# EAGLE design Control (EAGLE 9.6.2)
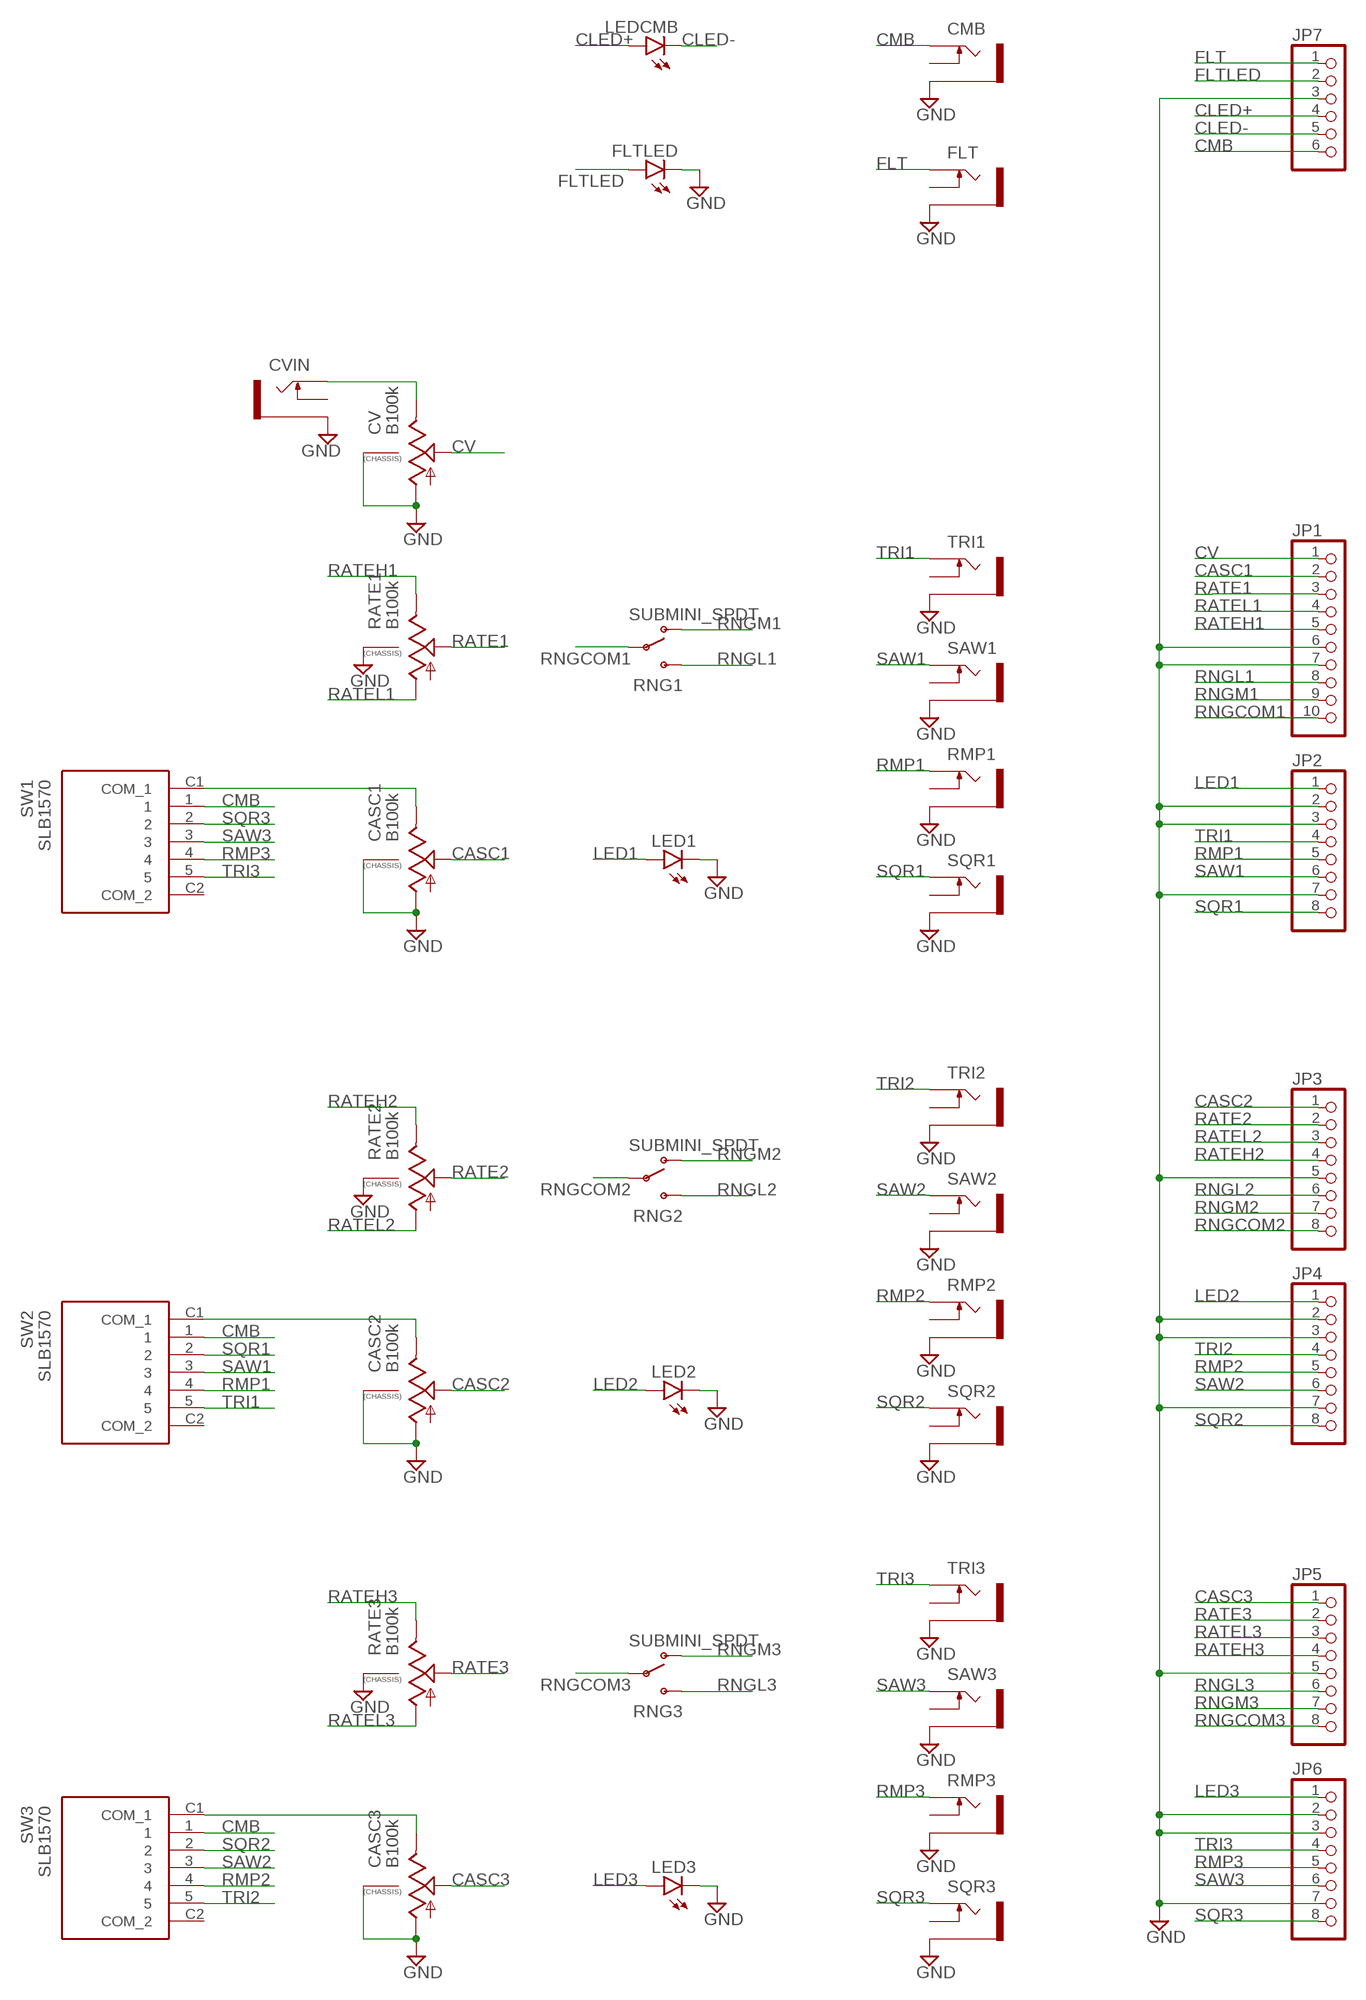
[diagram p0: schematic, sheet 1]

## Parts
CASC1  B100k  9MM_SNAP-IN_POT_CHASSIS  [9MM_SNAP-IN_POT]
CASC2  B100k  9MM_SNAP-IN_POT_CHASSIS  [9MM_SNAP-IN_POT]
CASC3  B100k  9MM_SNAP-IN_POT_CHASSIS  [9MM_SNAP-IN_POT]
CMB  THONKICONNNEW  [WQP-PJ301M-12_JACK]
CV  B100k  9MM_SNAP-IN_POT_CHASSIS  [9MM_SNAP-IN_POT]
CVIN  THONKICONNNEW  [WQP-PJ301M-12_JACK]
FLT  THONKICONNNEW  [WQP-PJ301M-12_JACK]
FLTLED  LED3MM  [LED3MM]
JP1  PINHD-1X10  [1X10]
JP2  PINHD-1X8  [1X08]
JP3  PINHD-1X8  [1X08]
JP4  PINHD-1X8  [1X08]
JP5  PINHD-1X8  [1X08]
JP6  PINHD-1X8  [1X08]
JP7  PINHD-1X6  [1X06]
LED1  LED3MM  [LED3MM]
LED2  LED3MM  [LED3MM]
LED3  LED3MM  [LED3MM]
LEDCMB  LED3MM  [LED3MM]
RATE1  B100k  9MM_SNAP-IN_POT_CHASSIS  [9MM_SNAP-IN_POT]
RATE2  B100k  9MM_SNAP-IN_POT_CHASSIS  [9MM_SNAP-IN_POT]
RATE3  B100k  9MM_SNAP-IN_POT_CHASSIS  [9MM_SNAP-IN_POT]
RMP1  THONKICONNNEW  [WQP-PJ301M-12_JACK]
RMP2  THONKICONNNEW  [WQP-PJ301M-12_JACK]
RMP3  THONKICONNNEW  [WQP-PJ301M-12_JACK]
RNG1  SUBMINI_SPDT  [SUBMINI_TOGGLE]
RNG2  SUBMINI_SPDT  [SUBMINI_TOGGLE]
RNG3  SUBMINI_SPDT  [SUBMINI_TOGGLE]
SAW1  THONKICONNNEW  [WQP-PJ301M-12_JACK]
SAW2  THONKICONNNEW  [WQP-PJ301M-12_JACK]
SAW3  THONKICONNNEW  [WQP-PJ301M-12_JACK]
SQR1  THONKICONNNEW  [WQP-PJ301M-12_JACK]
SQR2  THONKICONNNEW  [WQP-PJ301M-12_JACK]
SQR3  THONKICONNNEW  [WQP-PJ301M-12_JACK]
SW1  SLB1570  [SLB1570]
SW2  SLB1570  [SLB1570]
SW3  SLB1570  [SLB1570]
TRI1  THONKICONNNEW  [WQP-PJ301M-12_JACK]
TRI2  THONKICONNNEW  [WQP-PJ301M-12_JACK]
TRI3  THONKICONNNEW  [WQP-PJ301M-12_JACK]

## Nets
CASC1: CASC1.2(S) JP1.2
CASC2: CASC2.2(S) JP3.1
CASC3: CASC3.2(S) JP5.1
CLED+: JP7.4 LEDCMB.A
CLED-: JP7.5 LEDCMB.K(C)
CMB: CMB.P$1_TIP(TIP) JP7.6 SW1.1 SW2.1 SW3.1
CV: CV.2(S) JP1.1
FLT: FLT.P$1_TIP(TIP) JP7.1
FLTLED: FLTLED.A JP7.2
GND: CASC1.1(A) CASC1.CHASSIS1 CASC1.CHASSIS2 CASC2.1(A) CASC2.CHASSIS1 CASC2.CHASSIS2 CASC3.1(A) CASC3.CHASSIS1 CASC3.CHASSIS2 CMB.P$3_SLEEVE(SLEEVE) CV.1(A) CV.CHASSIS1 CV.CHASSIS2 CVIN.P$3_SLEEVE(SLEEVE) FLT.P$3_SLEEVE(SLEEVE) FLTLED.K(C) JP1.6 JP1.7 JP2.2 JP2.3 JP2.7 JP3.5 JP4.2 JP4.3 JP4.7 JP5.5 JP6.2 JP6.3 JP6.7 JP7.3 LED1.K(C) LED2.K(C) LED3.K(C) RATE1.CHASSIS1 RATE1.CHASSIS2 RATE2.CHASSIS1 RATE2.CHASSIS2 RATE3.CHASSIS1 RATE3.CHASSIS2 RMP1.P$3_SLEEVE(SLEEVE) RMP2.P$3_SLEEVE(SLEEVE) RMP3.P$3_SLEEVE(SLEEVE) SAW1.P$3_SLEEVE(SLEEVE) SAW2.P$3_SLEEVE(SLEEVE) SAW3.P$3_SLEEVE(SLEEVE) SQR1.P$3_SLEEVE(SLEEVE) SQR2.P$3_SLEEVE(SLEEVE) SQR3.P$3_SLEEVE(SLEEVE) TRI1.P$3_SLEEVE(SLEEVE) TRI2.P$3_SLEEVE(SLEEVE) TRI3.P$3_SLEEVE(SLEEVE)
LED1: JP2.1 LED1.A
LED2: JP4.1 LED2.A
LED3: JP6.1 LED3.A
N$1: CV.3(E) CVIN.P$1_TIP(TIP)
N$5: CASC1.3(E) SW1.C1(COM_1)
N$18: CASC2.3(E) SW2.C1(COM_1)
N$24: CASC3.3(E) SW3.C1(COM_1)
RATE1: JP1.3 RATE1.2(S)
RATE2: JP3.2 RATE2.2(S)
RATE3: JP5.2 RATE3.2(S)
RATEH1: JP1.5 RATE1.3(E)
RATEH2: JP3.4 RATE2.3(E)
RATEH3: JP5.4 RATE3.3(E)
RATEL1: JP1.4 RATE1.1(A)
RATEL2: JP3.3 RATE2.1(A)
RATEL3: JP5.3 RATE3.1(A)
RMP1: JP2.5 RMP1.P$1_TIP(TIP) SW2.4
RMP2: JP4.5 RMP2.P$1_TIP(TIP) SW3.4
RMP3: JP6.5 RMP3.P$1_TIP(TIP) SW1.4
RNGCOM1: JP1.10 RNG1.COM(COMMON)
RNGCOM2: JP3.8 RNG2.COM(COMMON)
RNGCOM3: JP5.8 RNG3.COM(COMMON)
RNGL1: JP1.8 RNG1.3(S)
RNGL2: JP3.6 RNG2.3(S)
RNGL3: JP5.6 RNG3.3(S)
RNGM1: JP1.9 RNG1.1(O)
RNGM2: JP3.7 RNG2.1(O)
RNGM3: JP5.7 RNG3.1(O)
SAW1: JP2.6 SAW1.P$1_TIP(TIP) SW2.3
SAW2: JP4.6 SAW2.P$1_TIP(TIP) SW3.3
SAW3: JP6.6 SAW3.P$1_TIP(TIP) SW1.3
SQR1: JP2.8 SQR1.P$1_TIP(TIP) SW2.2
SQR2: JP4.8 SQR2.P$1_TIP(TIP) SW3.2
SQR3: JP6.8 SQR3.P$1_TIP(TIP) SW1.2
TRI1: JP2.4 SW2.5 TRI1.P$1_TIP(TIP)
TRI2: JP4.4 SW3.5 TRI2.P$1_TIP(TIP)
TRI3: JP6.4 SW1.5 TRI3.P$1_TIP(TIP)
Unconnected: CMB.P$2_SWITCH(SWITCH) CVIN.P$2_SWITCH(SWITCH) FLT.P$2_SWITCH(SWITCH) RMP1.P$2_SWITCH(SWITCH) RMP2.P$2_SWITCH(SWITCH) RMP3.P$2_SWITCH(SWITCH) SAW1.P$2_SWITCH(SWITCH) SAW2.P$2_SWITCH(SWITCH) SAW3.P$2_SWITCH(SWITCH) SQR1.P$2_SWITCH(SWITCH) SQR2.P$2_SWITCH(SWITCH) SQR3.P$2_SWITCH(SWITCH) SW1.C2(COM_2) SW2.C2(COM_2) SW3.C2(COM_2) TRI1.P$2_SWITCH(SWITCH) TRI2.P$2_SWITCH(SWITCH) TRI3.P$2_SWITCH(SWITCH)

## Library data of the parts
CASC1-CASC3 CV RATE1-RATE3 = MusicThingModular:9MM_SNAP-IN_POT_CHASSIS: 9mm vertical snap-in pot, Alpha / Panasonic style, with a connection to the metal chassis for grounding
CMB CVIN FLT RMP1-RMP3 SAW1-SAW3 SQR1-SQR3 TRI1-TRI3 = MusicThingModular:THONKICONN: 3.5mm socket for Eurorack modular synths
FLTLED LED1-LED3 LEDCMB = led:LED: LED OSRAM: - CHIPLED LG R971, LG N971, LY N971, LG Q971, LY Q971, LO R971, LY R971 LH N974, LH R974 LS Q976, LO Q976, LY Q976 LO Q996 - Hyper CHIPLED LW Q18S LB Q993, LB Q99A, LB R99A - SideLED LS A670, LO A670, LY A670, LG A670, LP A670 LB A673, LV A673, LT A673, LW A673 LH A674 LY A675 LS A676, LA A676, LO A676, LY A676, LW A676 LS A679, LY A679, LG A679 - Hyper Micro SIDELED® LS Y876, LA Y876, LO Y876, LY Y876 LT Y87S - SmartLED LW L88C, LW L88S LB L89C, LB L89S, LG L890 LS L89K, LO L89K, LY L89K LS L896, LA L896, LO L896, LY L896 - TOPLED LS T670, LO T670, LY T670, LG T670, LP T670 LSG T670, LSP T670, LSY T670, LOP T670, LYG T670 LG T671, LOG T671, LSG T671 LB T673, LV T673, LT T673, LW T673 LH T674 LS T676, LA T676, LO T676, LY T676, LB T676, LH T676, LSB T676, LW T676 LB T67C, LV T67C, LT T67C, LS T67K, LO T67K, LY T67K, LW E67C LS E67B, LA E67B, LO E67B, LY E67B, LB E67C, LV E67C, LT E67C LW T67C LS T679, LY T679, LG T679 LS T770, LO T770, LY T770, LG T770, LP T770 LB T773, LV T773, LT T773, LW T773 LH T774 LS E675, LA E675, LY E675, LS T675 LS T776, LA T776, LO T776, LY T776, LB T776 LHGB T686 LT T68C, LB T68C - Hyper Mini TOPLED® LB M676 - Mini TOPLED Santana® LG M470 LS M47K, LO M47K, LY M47K Source: http://www.osram.convergy.de LUXEON: - LUMILED® LXK2-PW12-R00, LXK2-PW12-S00, LXK2-PW14-U00, LXK2-PW14-V00 LXK2-PM12-R00, LXK2-PM12-S00, LXK2-PM14-U00 LXK2-PE12-Q00, LXK2-PE12-R00, LXK2-PE12-S00, LXK2-PE14-T00, LXK2-PE14-U00 LXK2-PB12-K00, LXK2-PB12-L00, LXK2-PB12-M00, LXK2-PB14-N00, LXK2-PB14-P00, LXK2-PB14-Q00 LXK2-PR12-L00, LXK2-PR12-M00, LXK2-PR14-Q00, LXK2-PR14-R00 LXK2-PD12-Q00, LXK2-PD12-R00, LXK2-PD12-S00 LXK2-PH12-R00, LXK2-PH12-S00 LXK2-PL12-P00, LXK2-PL12-Q00, LXK2-PL12-R00 Source: www.luxeon.com KINGBRIGHT: KA-3528ASYC Source: www.kingbright.com
JP1 = pinhead:PINHD-1X10: PIN HEADER
JP2-JP6 = pinhead:PINHD-1X8: PIN HEADER
JP7 = pinhead:PINHD-1X6: PIN HEADER
RNG1-RNG3 = MusicThingModular:SUBMINI_SPDT
SW1-SW3 = SLB1570:SLB1570: Slide Switches MINI SLIDE SWITCH Source: Datasheet <https://componentsearchengine.com/Datasheets/1/SLB1570.pdf>; DESCRIPTION: Slide Switches MINI SLIDE SWITCH; HEIGHT: 12.5mm; MANUFACTURER_NAME: Apem; MANUFACTURER_PART_NUMBER: SLB1570; MOUSER_PART_NUMBER: 642-SLB1570; MOUSER_PRICE-STOCK: https://www.mouser.co.uk/ProductDetail/Apem/SLB1570?qs=i1KciFEqNAYRCX6bybaRtw%3D%3D

## Board
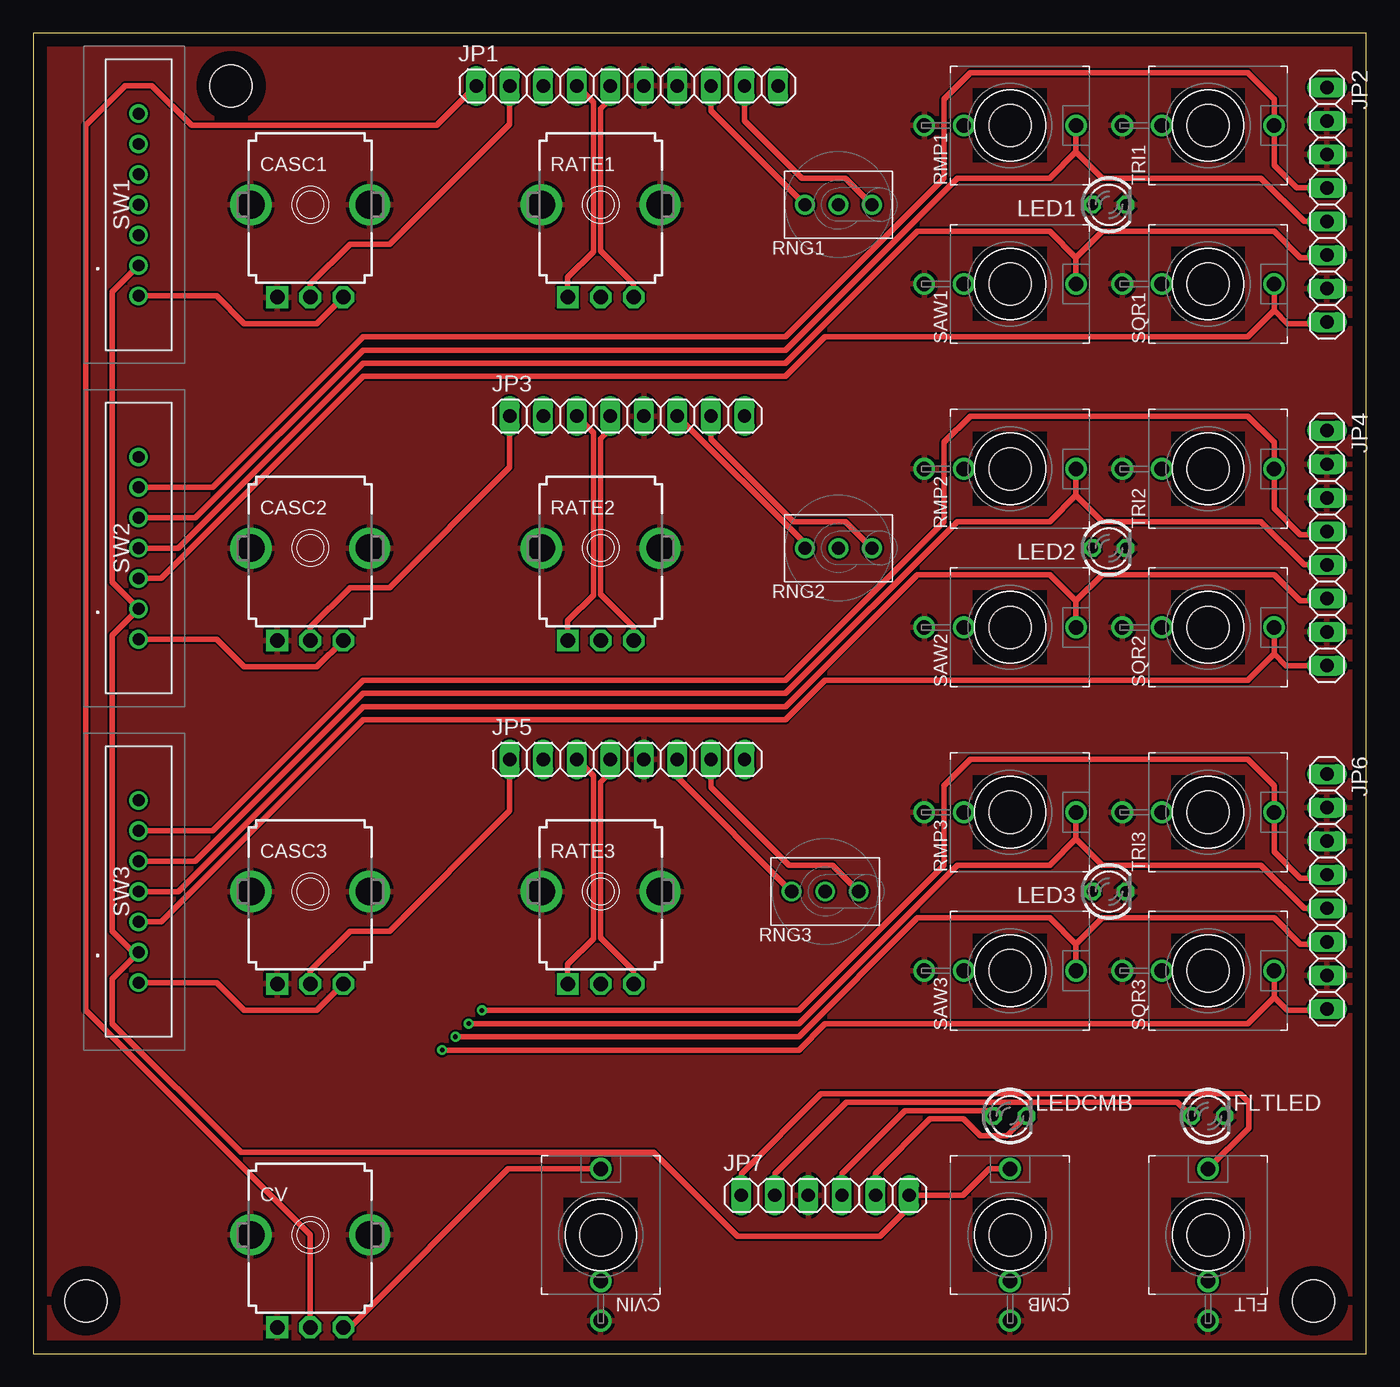
[diagram p1: board, top side]
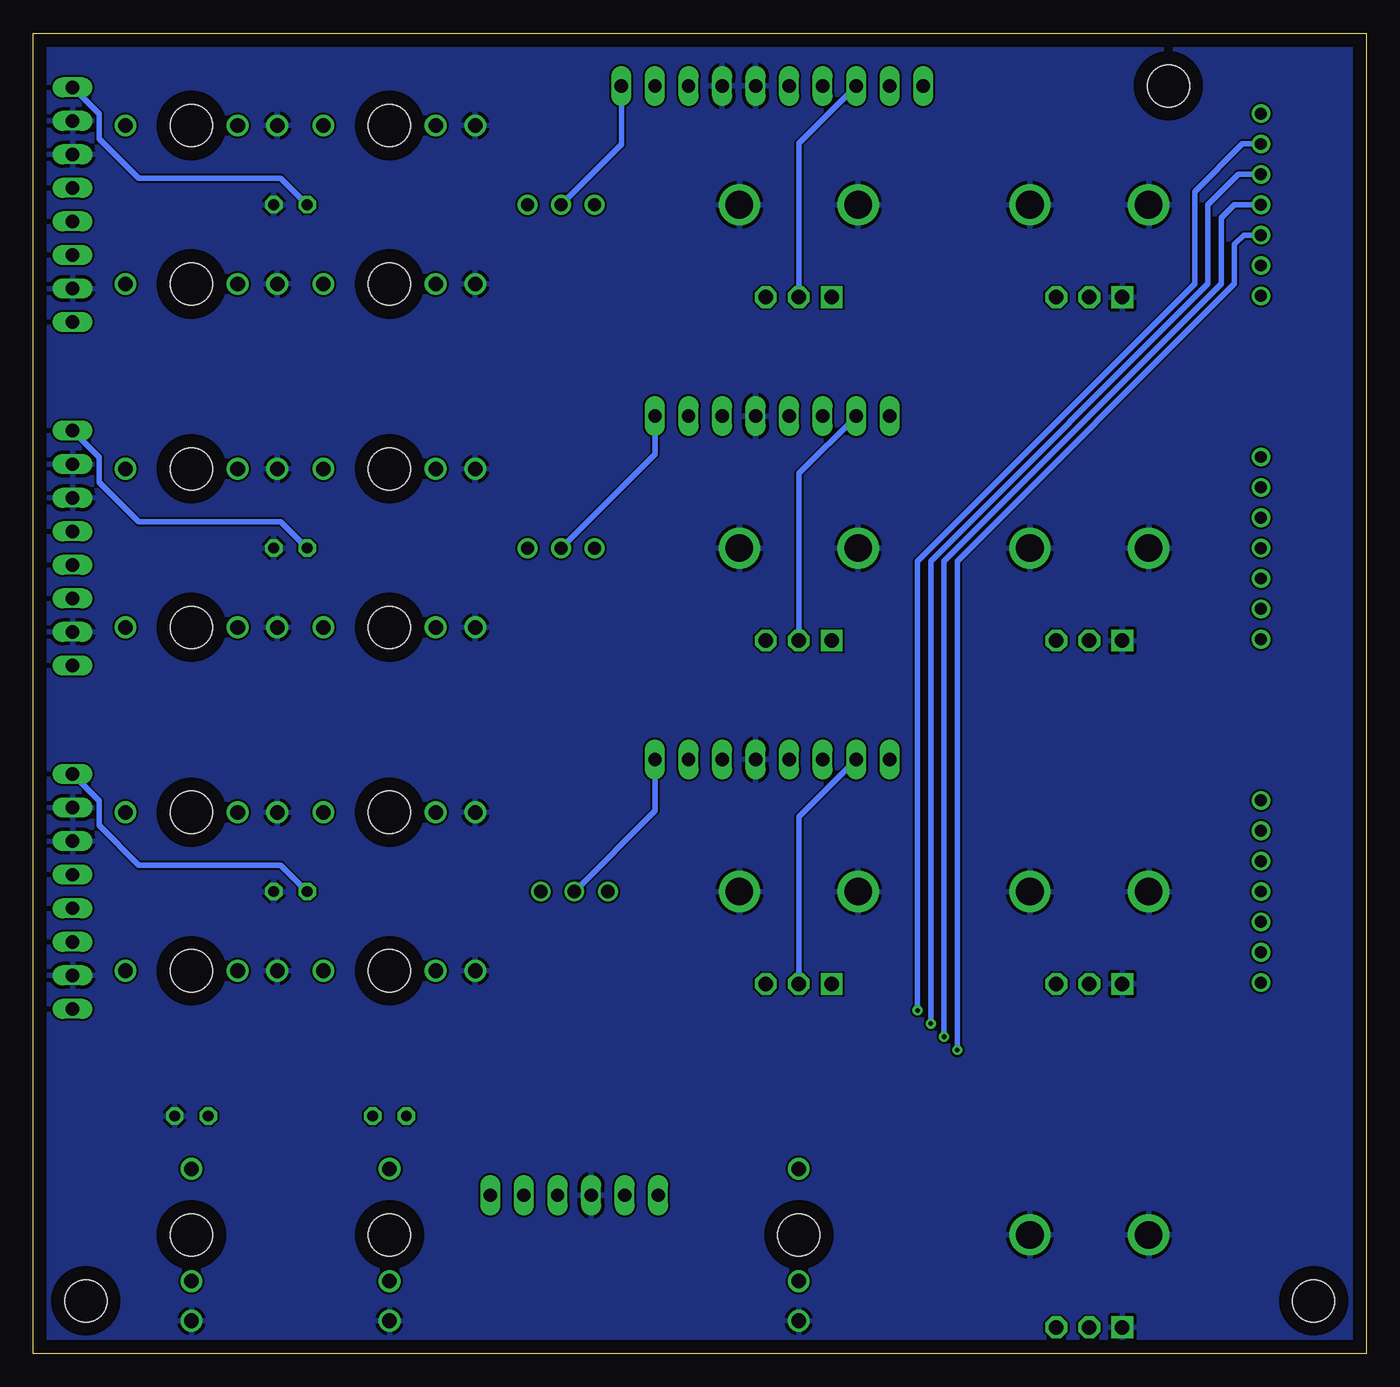
[diagram p2: board, bottom side, seen from below]

Size 101 x 100 mm. Coordinates in mm from the lower left corner, seen from the top.
Outline: 0,0 101,0 101,100 0,100 0,0
Copper layers (1*16): Top 0.035mm / dielectric 1.5mm / Bottom 0.035mm
Design rules "default": minimum track width 6mil, minimum drill 0.35mm, track to track 6mil, track to pad 6mil, pad to pad 6mil, via to via 6mil, smd to smd 6mil, copper to edge 40mil, drill to drill 6mil, minimum pad ring 10mil, minimum via ring 8mil, stop-mask expansion 4mil, vias tented up to drill 0mil, thermal gap 10mil
Holes 3.2 mm at 15,96 4,4 97,4 74,93 89,93 74,81 89,81 89,67 74,67 74,55 89,55 89,41 74,41 74,29 89,29 89,9 74,9 43,9

### Footprints (pad centres in the part's own frame; a part is rotated, then mirrored left to right if it is on the bottom)
9MM_SNAP-IN_POT = drill 1.1 square: 1 -2.5,-7 | drill 1.1 octagon: 2 0,-7; 3 2.5,-7 | drill 2.1 pad 2.794: CHASSIS1 -4.5,0; CHASSIS2 4.5,0
WQP-PJ301M-12_JACK = drill 1.1: P$1_TIP 0,5; P$2_SWITCH 0,-3.5; P$3_SLEEVE 0,-6.5
LED3MM = drill 0.813 octagon: A -1.27,0; K 1.27,0
1X10 = drill 1.016 long: 1 -11.43,0; 2 -8.89,0; 3 -6.35,0; 4 -3.81,0; 5 -1.27,0; 6 1.27,0; 7 3.81,0; 8 6.35,0; 9 8.89,0; 10 11.43,0
1X08 = drill 1.016 long: 1 -8.89,0; 2 -6.35,0; 3 -3.81,0; 4 -1.27,0; 5 1.27,0; 6 3.81,0; 7 6.35,0; 8 8.89,0
1X06 = drill 1.016 long: 1 -6.35,0; 2 -3.81,0; 3 -1.27,0; 4 1.27,0; 5 3.81,0; 6 6.35,0
SUBMINI_TOGGLE = drill 1 pad 1.422: 1 -2.54,0; 3 2.54,0; COM 0,0
SLB1570 = drill 0.9 pad 1.4: 1 0,0; 2 2.3,0; 3 4.6,0; 4 6.9,0; 5 9.2,0; C1 -2.3,0; C2 11.5,0

### Placement (x,y rotation side)
CASC1  21,87 0 top
CASC2  21,61 0 top
CASC3  21,35 0 top
CMB  74,9 0 top
CV  21,9 0 top
CVIN  43,9 0 top
FLT  89,9 0 top
FLTLED  89,18 0 top
JP1  45,96 0 top
JP2  98,87 270 top
JP3  45,71 0 top
JP4  98,61 270 top
JP5  45,45 0 top
JP6  98,35 270 top
JP7  60,12 0 top
LED1  81.5,87 0 top
LED2  81.5,61 0 top
LED3  81.5,35 0 top
LEDCMB  74,18 0 top
RATE1  43,87 0 top
RATE2  43,61 0 top
RATE3  43,35 0 top
RMP1  74,93 270 top
RMP2  74,67 270 top
RMP3  74,41 270 top
RNG1  61,87 180 top
RNG2  61,61 180 top
RNG3  60,35 180 top
SAW1  74,81 270 top
SAW2  74,55 270 top
SAW3  74,29 270 top
SQR1  89,81 270 top
SQR2  89,55 270 top
SQR3  89,29 270 top
SW1  8,82.4 90 top
SW2  8,56.4 90 top
SW3  8,30.4 90 top
TRI1  89,93 270 top
TRI2  89,67 270 top
TRI3  89,41 270 top

### Tracks (layer width: path | path; a pad name or v marks a point on that pad's centre or on a via)
CASC1
  Top 0.152: 36.11,95.11 36.11,95
  Top 0.305: JP1.2 36.11,95.11
  Top 0.406: CASC1.2 21,81 24,84 27,84 36.11,93.11 36.11,95
CASC2
  Top 0.406: CASC2.2 21,55 24,58 27,58 36.11,67.11 JP3.1
CASC3
  Top 0.406: CASC3.2 21,29 24,32 27,32 36.11,41.11 JP5.1
CLED+
  Top 0.406: LEDCMB.A 72.31,18.41 66.04,18.41 61.27,13.64 JP7.4
CLED-
  Top 0.406: LEDCMB.K 73.78,16.51 71.75,16.51 70.48,17.78 67.94,17.78 63.81,13.64 JP7.5
CMB
  Top 0.305: 66.35,11.11 JP7.6
  Top 0.406: SW1.1 6,80.4 6,58.4 SW2.1 6,54.4 6,32 7.6,30.4 SW3.1 6,28.4 6,25 15.76,15.24 46.99,15.24 53.34,8.89 64.14,8.89 66.35,11.11 | CMB.P$1_TIP 72.42,14 70.42,12 JP7.6
CV
  Top 0.406: CV.2 21,9 4,26 4,93 7,96 9,96 12,93 30.57,93 JP1.1
FLT
  Top 0.406: FLT.P$1_TIP 92.08,17.07 92.08,19.05 91.44,19.68 59.69,19.68 53.65,13.64 JP7.1
FLTLED
  Top 0.406: FLTLED.A 86.68,19.05 61.59,19.05 56.19,13.64 JP7.2
GND
  pour Top: 0,100 101,100 101,0 0,0
  pour Bottom: 0,100 101,100 101,0 0,0
LED1
  Bottom 0.406: JP2.1 96,93.89 96,92 93,89 82.23,89 LED1.A
LED2
  Bottom 0.406: JP4.1 96,67.89 96,66 93,63 82.23,63 LED2.A
LED3
  Bottom 0.406: JP6.1 96,41.89 96,40 93,37 82.23,37 LED3.A
N$1
  Top 0.406: CV.3 24,2 36,14 CVIN.P$1_TIP
N$5
  Top 0.406: SW1.C1 13.9,80.1 16,78 21.5,78 CASC1.3
N$18
  Top 0.406: SW2.C1 13.9,54.1 16,52 21.5,52 CASC2.3
N$24
  Top 0.406: SW3.C1 13.9,28.1 16,26 21.5,26 CASC3.3
RATE1
  Bottom 0.406: JP1.3 43,91.65 RATE1.2
RATE2
  Bottom 0.406: RATE2.2 43,66.65 JP3.2
RATE3
  Bottom 0.406: RATE3.2 43,40.65 JP5.2
RATEH1
  Top 0.305: RATE1.3 45.5,80.5
  Top 0.406: JP1.5 43.73,95 43,94.27 43,83.5 45.5,81 45.5,80.5
RATEH2
  Top 0.406: RATE2.3 45.5,55 43,57.5 43,69.27 43.73,70 JP3.4
RATEH3
  Top 0.406: RATE3.3 45.5,29 43,31.5 43,43.27 43.73,44 JP5.4
RATEL1
  Top 0.406: RATE1.1 40.5,81.5 42.44,83.44 42.44,94.75 JP1.4
RATEL2
  Top 0.406: RATE2.1 40.5,55.5 42.44,57.44 42.44,69.75 JP3.3
RATEL3
  Top 0.406: RATE3.1 40.5,29.5 42.44,31.44 42.44,43.75 JP5.3
RMP1
  Top 0.406: RMP1.P$1_TIP 79,91 | 79,91 81,89 93,89 96.27,85.73 JP2.5 | SW2.4 12.3,63.3 25,76 57,76 70,89 77,89 79,91
RMP2
  Top 0.406: 79,65 81,63 93,63 96.27,59.73 JP4.5 | SW3.4 12.3,37.3 25,50 57,50 70,63 77,63 79,65 | 79,65 RMP2.P$1_TIP
RMP3  (via drill 0.35)
  Top 0.406: 79,39 81,37 93,37 96.27,33.73 JP6.5 | RMP3.P$1_TIP 79,39 | 79,39 77,37 70,37 58,25 v33,25
  Bottom 0.406: SW1.4 9.7,89.3 12,87 12,81 33,60 v33,25
RNGCOM1
  Bottom 0.406: RNG1.COM 56.43,91.57 JP1.10
RNGCOM2
  Bottom 0.406: RNG2.COM 53.89,68.11 JP3.8
RNGCOM3
  Bottom 0.406: RNG3.COM 53.89,41.11 JP5.8
RNGL1
  Top 0.406: RNG1.3 51.35,94.11 JP1.8
RNGL2
  Top 0.406: RNG2.3 58.46,61.35 JP3.6
RNGL3
  Top 0.406: RNG3.3 48.81,43.65 JP5.6
RNGM1
  Top 0.406: RNG1.1 61.54,89 58.25,89 53.89,93.36 JP1.9
RNGM2
  Top 0.406: RNG2.1 61.54,63 57.6,63 51.35,69.25 JP3.7
RNGM3
  Top 0.406: RNG3.1 60.54,37 57.25,37 51.35,42.9 JP5.7
SAW1
  Top 0.406: 79,83 81,85 94,85 96,83 97.81,83 JP2.6 | SAW1.P$1_TIP 79,83 | SW2.3 11,61 25,75 57,75 67,85 77,85 79,83
SAW2
  Top 0.406: JP4.6 97.81,57 96,57 94,59 81,59 79,57 | SW3.3 11,35 25,49 57,49 67,59 77,59 79,57 | 79,57 SAW2.P$1_TIP
SAW3  (via drill 0.35)
  Top 0.406: 79,31 81,33 94,33 96,31 97.81,31 JP6.6 | SAW3.P$1_TIP 79,31 | v32,24 58,24 67,33 77,33 79,31
  Bottom 0.406: SW1.3 10,87 11,86 11,81 32,60 v32,24
SQR1
  Top 0.406: SQR1.P$1_TIP 94,79 | 94,79 95,78 97.89,78 JP2.8 | SW2.2 9.7,58.7 25,74 57,74 60,77 92,77 94,79
SQR2
  Top 0.406: SW3.2 9.7,32.7 25,48 57,48 60,51 92,51 94,53 | SQR2.P$1_TIP 94,53 | 94,53 94.89,52.11 JP4.8
SQR3  (via drill 0.35)
  Top 0.406: SQR3.P$1_TIP 94,27 | 94,27 95,26 97.89,26 JP6.8 | 94,27 92,25 60,25 58,23 v31,23
  Bottom 0.406: SW1.2 9.3,84.7 10,84 10,81 31,60 v31,23
TRI1
  Top 0.406: JP2.4 95.73,88.27 94,90 TRI1.P$1_TIP 94,95 92,97 71,97 69,95 69,89 57,77 25,77 13.6,65.6 SW2.5
TRI2
  Top 0.406: JP4.4 97.73,62 96,62 94,64 TRI2.P$1_TIP 94,69 92,71 71,71 69,69 69,63 57,51 25,51 13.6,39.6 SW3.5
TRI3  (via drill 0.35)
  Top 0.406: JP6.4 97.73,36 96,36 94,38 TRI3.P$1_TIP 94,43 92,45 71,45 69,43 69,37 58,26 v34,26
  Bottom 0.406: v34,26 34,60 13,81 13,88 9.4,91.6 SW1.5